# EAGLE design HMC5983 Breakout (EAGLE 8.3.0)
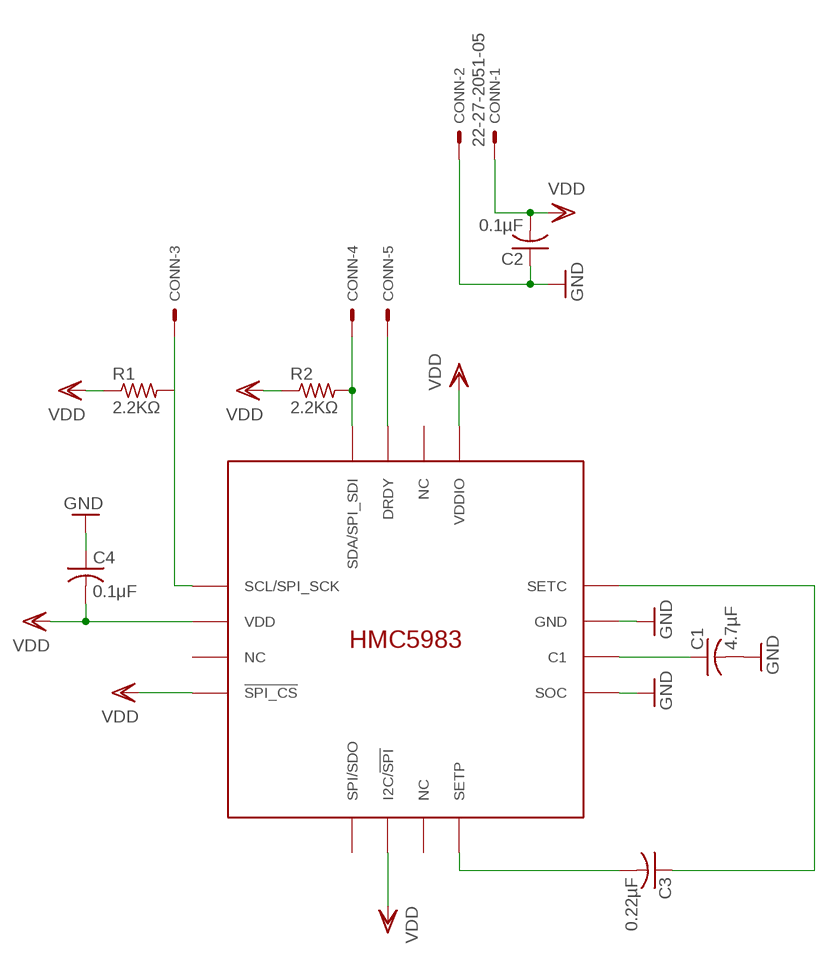
[diagram p0: schematic, sheet 1]

## Parts
C1  4.7µF  C-USC0805  [C0805]
C2  0.1µF  C-USC0805  [C0805]
C3  0.22µF  C-USC0805  [C0805]
C4  0.1μF  C-USC0805  [C0805]
CONN  22-27-2051-05  [6410-05]
R1  2.2KΩ  R-US_R0805  [R0805]
R2  2.2KΩ  R-US_R0805  [R0805]
U$1  HMC5983  [HMC5983]

## Nets
GND: C1.2 C2.1 C4.1 CONN.2 U$1.GND U$1.SOC
N$1: CONN.4 R2.2 U$1.SDA/SPI_SDI
N$2: CONN.3 R1.2 U$1.SCL/SPI_SCK
N$4: CONN.5 U$1.DRDY
N$5: C1.1 U$1.C1
N$6: C3.2 U$1.SETP
N$7: C3.1 U$1.SETC
VDD: C2.2 C4.2 CONN.1 R1.1 R2.1 U$1.!SPI_CS U$1.I2C/!SPI U$1.VDD U$1.VDDIO
Unconnected: U$1.NC@1(NC) U$1.NC@2(NC) U$1.NC@3(NC) U$1.SPI_SDO(SPI/SDO)

## Library data of the parts
C1-C4 = rcl:C-US: CAPACITOR, American symbol
CONN = con-molex:22-?-05: CONNECTOR wire to board 2.54 mm (.1 inch) pitch header; OC_FARNELL: unknown; OC_NEWARK: unknown
R1 R2 = rcl:R-US_: RESISTOR, American symbol
U$1 = DubSat1 Components:HMC5983

## Board
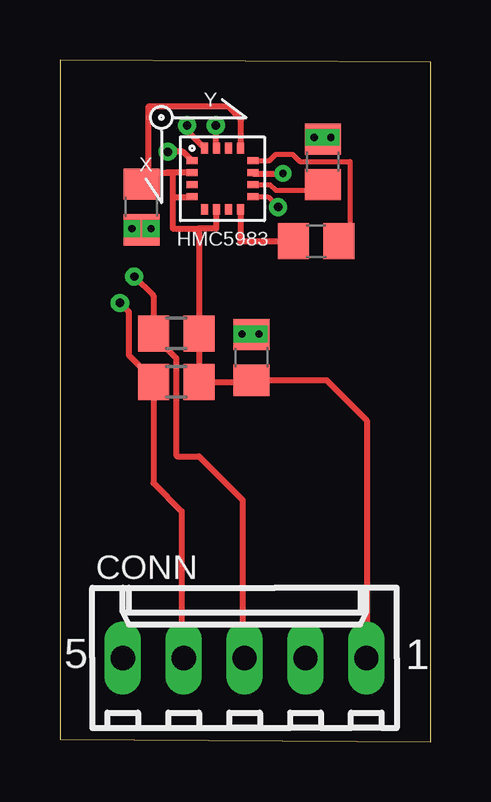
[diagram p1: board, top side]
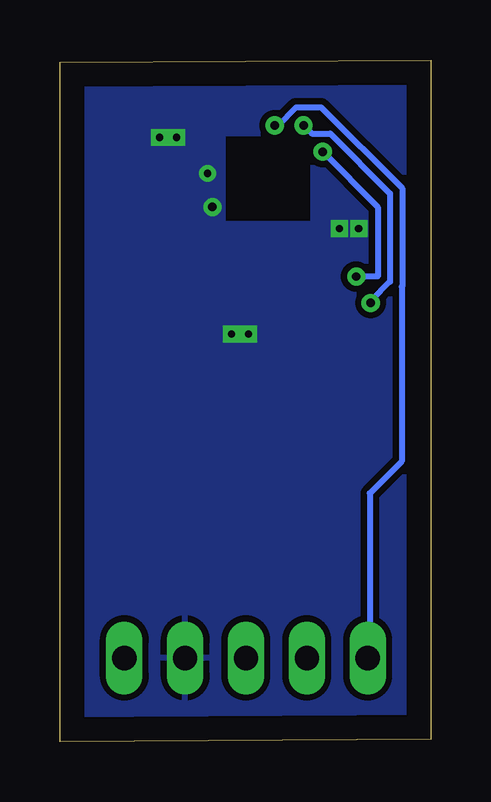
[diagram p2: board, bottom side, seen from below]

Size 15.46 x 28.43 mm. Coordinates in mm from the lower left corner, seen from the top.
Outline: 0,0.1 15.46,0 15.46,28.33 0,28.43 0,0.1
Copper layers (1*16): Top 0.035mm / dielectric 1.5mm / Bottom 0.035mm
Design rules "default *": minimum track width 6mil, minimum drill 0.3mm, track to track 10mil, track to pad 10mil, pad to pad 10mil, via to via 10mil, smd to smd 6mil, copper to edge 40mil, drill to drill 6mil, minimum pad ring 10mil, minimum via ring 8mil, stop-mask expansion 4mil, vias tented up to drill 0mil, thermal gap 10mil

### Footprints (pad centres in the part's own frame; a part is rotated, then mirrored left to right if it is on the bottom)
C0805 = smd 1.3 x 1.5: 1 -0.95,0; 2 0.95,0
6410-05 = drill 1.016 long: 1 5.08,0; 2 2.54,0; 3 0,0; 4 -2.54,0; 5 -5.08,0
R0805 = smd 1.3 x 1.5: 1 -0.95,0; 2 0.95,0
HMC5983 = smd 0.45 x 0.3: !SPI_CS -1.275,-0.75; C1 1.275,-0.25; GND 1.275,0.25; NC@3 -1.275,-0.25; SCL/SPI_SCK -1.275,0.75; SETC 1.275,0.75; SOC 1.275,-0.75; VDD -1.275,0.25 | smd 0.3 x 0.45: DRDY -0.25,1.275; I2C/!SPI -0.25,-1.275; NC@1 0.25,1.275; NC@2 0.25,-1.275; SDA/SPI_SDI -0.75,1.275; SETP 0.75,-1.275; SPI_SDO -0.75,-1.275; VDDIO 0.75,1.275

### Placement (x,y rotation side)
C1  10.96,24.18 90 top
C2  7.99,16.03 270 top
C3  10.69,20.87 180 top
C4  3.4,22.3 90 top
CONN  7.7,3.5 0 top
R1  4.85,17.03 180 top
R2  4.85,15.01 180 top
U$1  6.78,23.48 0 top

### Tracks (layer width: path | path; a pad name or v marks a point on that pad's centre or on a via)
GND  (via drill 0.3, 0.35)
  Top 0.203: C1.2 11.03,25.2 v11.3,25.2 | C2.1 8.01,17 v8.3,17 | U$1.SOC 8.67,22.73 v9.1,22.3
  Top 0.254: U$1.GND 8.05,23.7 v9.3,23.7 | C4.1 3.45,21.4 v3.8,21.4
  other vias: 10.6,25.2 7.6,17 3,21.4
  pour Bottom: 0,28.66 15.38,28.56 15.48,0 0.1,0.1
N$1  (via drill 0.35)
  Top 0.254: U$1.SDA/SPI_SDI 5.3,25.48 v5.3,25.7 | v2.5,18.3 2.87,17.93 2.87,16.12 3.9,15.09 R2.2 3.9,10.79 5.08,9.61 5.08,3.58 CONN.4
  Bottom 0.254: v5.3,25.7 4.96,25.36 4.19,25.36 1.69,22.87 1.69,19.19 2.5,18.38 v2.5,18.3
N$2  (via drill 0.35)
  Top 0.254: U$1.SCL/SPI_SCK 5.13,24.6 v4.5,24.6 | v3.1,19.4 3.9,18.6 R1.2 3.9,16.95 4.85,16 4.85,11.95 4.9,11.9 5.8,11.9 7.62,10.08 7.62,3.58 CONN.3
  Bottom 0.254: v4.5,24.6 2.2,22.3 2.2,19.4 v3.1,19.4
N$4  (via drill 0.35)
  Top 0.254: U$1.DRDY 6.5,24.79 v6.5,25.7
  Bottom 0.254: v6.5,25.7 6.37,25.7 5.61,26.46 4.57,26.46 1.18,23.08 1.18,18.98 1.2,18.96 1.2,11.7 2.54,10.36 2.54,3.58 CONN.5
N$5
  Top 0.203: U$1.C1 8.77,23.23 9,23 10.73,23 C1.1
N$6
  Top 0.254: U$1.SETP 7.53,20.87 C3.2
N$7
  Top 0.203: U$1.SETC 8.73,24.23 9,24.5 9.7,24.5 10,24.2 12.1,24.2 12.1,21.33 C3.1
VDD
  Top 0.254: U$1.VDD 4.42,23.73 | 4.42,23.73 4.7,23.71 4.7,22.8 | 4.7,22.8 4.7,22.7 5.5,22.7 5.5,22.72 U$1.!SPI_CS | 3.7,23.73 4.42,23.73 | 4.7,22.8 4.7,21.4 5.8,21.4 | U$1.I2C/!SPI 6.53,21.4 6.5,21.4 5.8,21.4 | 3.7,23.73 3.7,26.5 7,26.5 7.56,25.94 7.56,24.76 U$1.VDDIO | C4.2 3.7,23.55 3.7,23.73 | 5.8,21.4 R1.1 R2.1 7.99,15.01 C2.2 11.12,15.08 12.8,13.4 12.8,3.52 CONN.1

### Text on the board
tDocu: HMC5983 | DRDY | SDA | SCL | GND | VDD